# Altium project MCU_SLAVE.PrjPcb
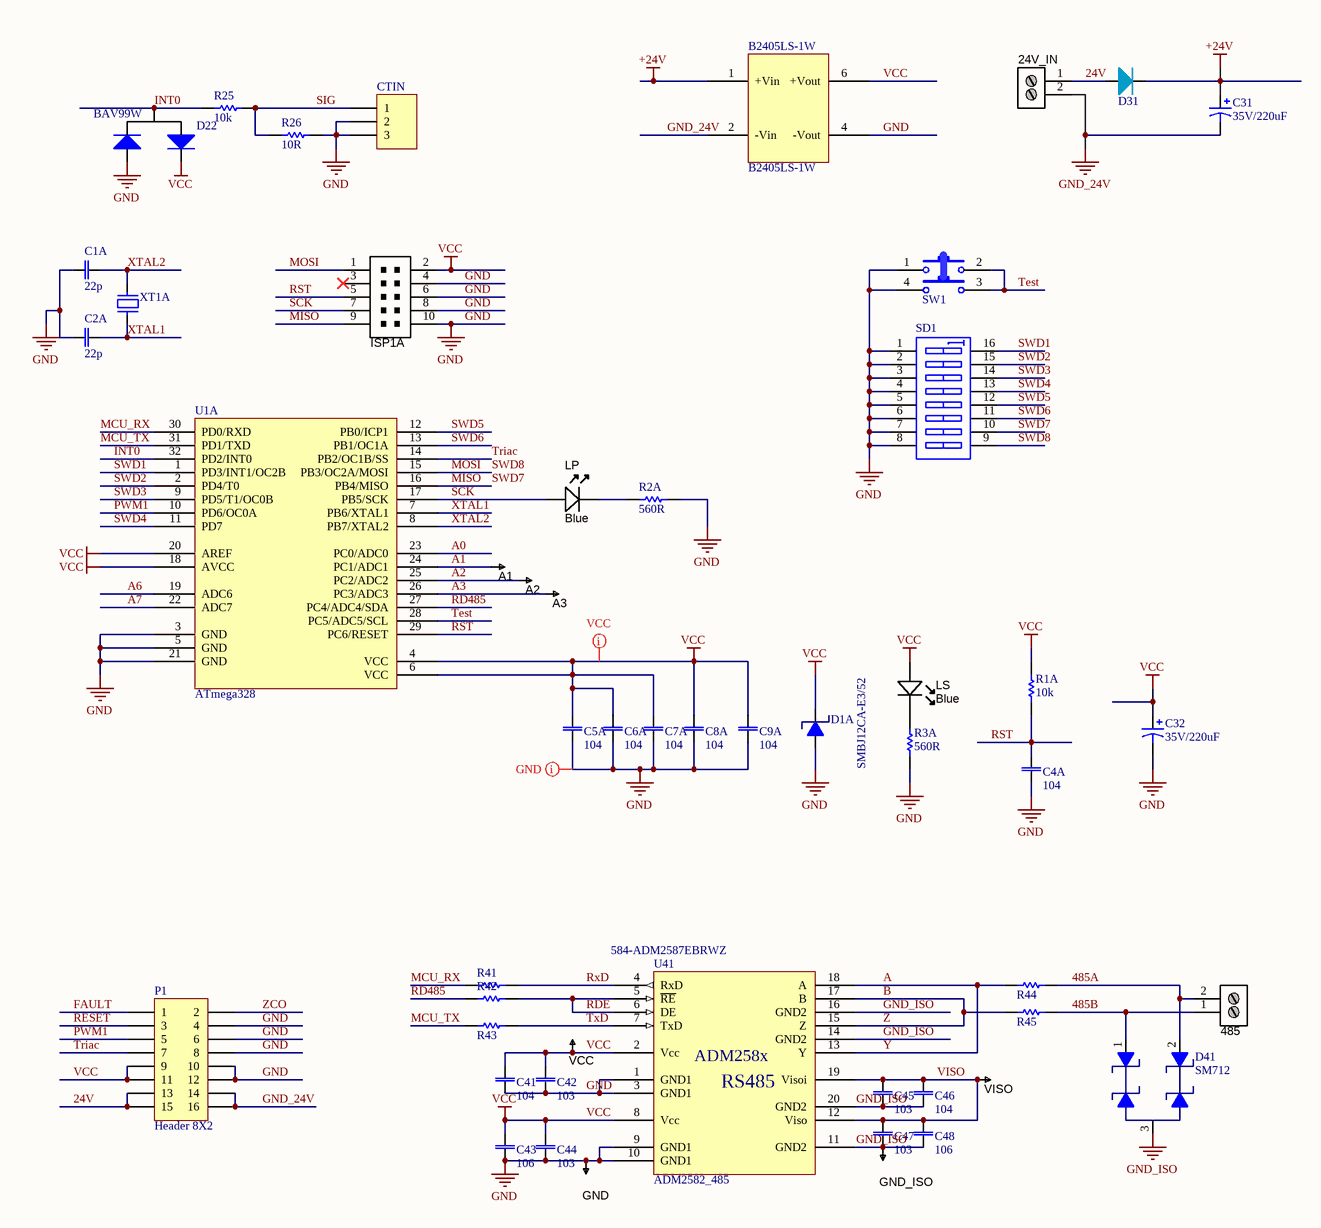
[diagram p0: MCU_SLAVE.SchDoc]
1 sheet, 52 parts. Net scope: global (net labels, ports and power ports of the same name join across sheets).
Board file: MCU_SLAVE.PcbDoc

## Sheet MCU_SLAVE.SchDoc
size A3; DocumentNumber: 2; SheetNumber: 1

### Parts
24V_IN  Giắc xanh 5.08mm  [2P_PCB1]  (value not drawn)
485  Giắc xanh 5.08mm  [2P_PCB1]  (value not drawn)
A1  TESTPOINT  [TP-R60]  (value not drawn)  (no BOM)
A2  TESTPOINT  [TP-R60]  (value not drawn)  (no BOM)
A3  TESTPOINT  [TP-R60]  (value not drawn)  (no BOM)
B2405LS-1W  B2405LS-1W  [Mornsun 1W]
C1A  value 22p  [CAPC2012N_F]  (hidden comment: Tụ điện dán 060322p)
C2A  value 22p  [CAPC2012N_F]  (hidden comment: Tụ điện dán 060322p)
C4A  value 104  [CAPC2012N_F]  (hidden comment: Tụ điện dán 0603104)
C5A  value 104  [CAPC2012N_F]  (hidden comment: Tụ điện dán 0805104)
C6A  value 104  [CAPC2012N_F]  (hidden comment: Tụ điện dán 0805104)
C7A  value 104  [CAPC2012N_F]  (hidden comment: Tụ điện dán 0603104)
C8A  value 104  [CAPC2012N_F]  (hidden comment: Tụ điện dán 0603104)
C9A  value 104  [CAPC2012N_F]  (hidden comment: Tụ điện dán 0603104)
C31  value 35V/220uF  [CAPE3.5-5.0MM_Rad_10x14mm]  (hidden comment: Tụ nhôm cắm35V/220uF)
C32  value 35V/220uF  [CAPE3.5-5.0MM_Rad_10x14mm]  (hidden comment: Tụ nhôm cắm35V/220uF)
C41  value 104  [CAPC2012N_F]  (hidden comment: Tụ điện dán 0805104)
C42  value 103  [CAPC2012N_F]  (hidden comment: Tụ điện dán 0805103)
C43  value 106  [CAPC2012N_F]  (hidden comment: Tụ điện dán 0805106)
C44  value 103  [CAPC2012N_F]  (hidden comment: Tụ điện dán 0805103)
C45  value 103  [CAPC2012N_F]  (hidden comment: Tụ điện dán 0805103)
C46  value 104  [CAPC2012N_F]  (hidden comment: Tụ điện dán 0805104)
C47  value 103  [CAPC2012N_F]  (hidden comment: Tụ điện dán 0805103)
C48  value 106  [CAPC2012N_F]  (hidden comment: Tụ điện dán 0805106)
CTIN  Header 3  [HDR1X3]  (value not drawn)
D1A  vl2: SMBJ12CA-E3/52  [DO-214AC]  (hidden comment: Đi ốt dánSMBJ12CA-E3/52)
D22  Đi ốt dánBAV99Wchân SOT-323  [SOT323]  (value not drawn)
D31  (no value)  [DO-214AC]
D41  SM712  [SOT23 TOP]
GND  TESTPOINT  [TP-R60]  (value not drawn)  (no BOM)
GND_ISO  TESTPOINT  [TP-R60]  (value not drawn)  (no BOM)
ISP1A  Giắc đôi 5x2 chân 2.54mm  [10P_PCB_HEADER_BRD_MNT]  (value not drawn)
LP  Blue  [LED-0805-K]
LS  Blue  [LED-0805-K]
P1  Header 8X2  [HDR2X8]
R1A  value 10k  [RESC2012N_F]  (hidden comment: Điện trở dán 060310k)
R2A  value 560R  [RESC2012N_F]  (hidden comment: Điện trở dán 0603560R)
R3A  value 560R  [RESC2012N_F]  (hidden comment: Điện trở dán 0603560R)
R25  value 10k  [RESC3216N]  (hidden comment: Điện trở dán 120610k)
R26  value 10R  [RESC3216N]  (hidden comment: Điện trở dán 120610R)
R41  Điện trở dán 08050R  [RESC2012N_F]  (value not drawn)
R42  Điện trở dán 08050R  [RESC2012N_F]  (value not drawn)
R43  Điện trở dán 08050R  [RESC2012N_F]  (value not drawn)
R44  Điện trở dán 08050R  [RESC2012N_F]  (value not drawn)
R45  Điện trở dán 08050R  [RESC2012N_F]  (value not drawn)
SD1  Công tắc gạt 8 kênh, 16 chân cắm DIP16  [DIP16/W0.3K]  (value not drawn)
SW1  Nút bấm 4 chân cắm12x12x6mm  [SW]  (value not drawn)
U1A  ATmega328  [TQFP32]
U41  ADM2582_485  Supplier Part Number 1: 584-ADM2587EBRWZ  [SO-20B]
VCC  TESTPOINT  [TP-R60]  (value not drawn)  (no BOM)
VISO  TESTPOINT  [TP-R60]  (value not drawn)  (no BOM)
XT1A  Thạch anh cắm 16MHz  [XT2]  (value not drawn)

### Nets
+24V: B2405LS-1W.1(+Vin) C31.1 D31.K
GND: B2405LS-1W.4(-Vout) C1A.2 C2A.2 C4A.1 C5A.1 C6A.1 C7A.1 C8A.1 C9A.1 C32.2 C41.1 C42.1 C43.1 C44.1 CTIN.2 CTIN.3 D1A.A D22.1(A) GND.1 ISP1A.4 ISP1A.6 ISP1A.8 ISP1A.10 P1.4 P1.6 P1.8 P1.10 P1.12 R2A.2 R3A.1 R26.1 SD1.1(A1) SD1.2(A2) SD1.3(A3) SD1.4(A4) SD1.5(A5) SD1.6(A6) SD1.7(A7) SD1.8(A8) SW1.1 SW1.4 U1A.3(GND) U1A.5(GND) U1A.21(GND) U41.1(GND1) U41.3(GND1) U41.9(GND1) U41.10(GND1)
GND_24V: 24V_IN.2 B2405LS-1W.2(-Vin) C31.2 P1.14 P1.16
GND_ISO: C45.1 C46.1 C47.1 C48.1 D41.3(GND) GND_ISO.1 U41.11(GND2) U41.14(GND2) U41.16(GND2) U41.20(GND2)
VCC: B2405LS-1W.6(+Vout) C5A.2 C6A.2 C7A.2 C8A.2 C9A.2 C32.1 C41.2 C42.2 C43.2 C44.2 D1A.K D22.2(K) ISP1A.2 LS.A P1.9 P1.11 R1A.2 U1A.4(VCC) U1A.6(VCC) U1A.18(AVCC) U1A.20(AREF) U41.2(Vcc) U41.8(Vcc) VCC.1
24V: 24V_IN.1 D31.A P1.13 P1.15
485A: 485.2 D41.2(IO2) R44.2
485B: 485.1 D41.1(IO1) R45.2
A: R44.1 U41.13(Y) U41.18(A)  [also labelled Y]
A0: U1A.23(PC0/ADC0)
A1: A1.1 U1A.24(PC1/ADC1)
A2: A2.1 U1A.25(PC2/ADC2)
A3: A3.1 U1A.26(PC3/ADC3)
A6: U1A.19(ADC6)
A7: U1A.22(ADC7)
B: R45.1 U41.15(Z) U41.17(B)  [also labelled Z]
FAULT: P1.1
INT0: D22.3(AK) R25.2 U1A.32(PD2/INT0)
MCU_RX: R41.1 U1A.30(PD0/RXD)
MCU_TX: R43.1 U1A.31(PD1/TXD)
MISO: ISP1A.9 SD1.10(B7) U1A.16(PB4/MISO)  [also labelled SWD7]
MOSI: ISP1A.1 SD1.9(B8) U1A.15(PB3/OC2A/MOSI)  [also labelled SWD8]
PWM1: P1.5 U1A.10(PD6/OC0A)
RD485: R42.1 U1A.27(PC4/ADC4/SDA)
RDE: R42.2 U41.5(~{RE}) U41.6(DE)
RESET: P1.3
RST: C4A.2 ISP1A.5 R1A.1 U1A.29(PC6/RESET)
RxD: R41.2 U41.4(RxD)
SCK: ISP1A.7 LP.A U1A.17(PB5/SCK)
SIG: CTIN.1 R25.1 R26.2
SWD1: SD1.16(B1) U1A.1(PD3/INT1/OC2B)
SWD2: SD1.15(B2) U1A.2(PD4/T0)
SWD3: SD1.14(B3) U1A.9(PD5/T1/OC0B)
SWD4: SD1.13(B4) U1A.11(PD7)
SWD5: SD1.12(B5) U1A.12(PB0/ICP1)
SWD6: SD1.11(B6) U1A.13(PB1/OC1A)
Test: SW1.2 SW1.3 U1A.28(PC5/ADC5/SCL)
Triac: P1.7 U1A.14(PB2/OC1B/SS)
TxD: R43.2 U41.7(TxD)
VISO: C45.2 C46.2 C47.2 C48.2 U41.12(Viso) U41.19(Visoi) VISO.1
XTAL1: C2A.1 U1A.7(PB6/XTAL1) XT1A.1
XTAL2: C1A.1 U1A.8(PB7/XTAL2) XT1A.2
ZCO: P1.2
NetLP_K: LP.K R2A.1
NetLS_K: LS.K R3A.2

Not connected (* = marked no-connect by the designer): ISP1A 3*

### Layout directives
rule Width Constraint [Pref Width = 10mil    Min Width = 10mil    Max Width = 30mil]: VCC
rule Width Constraint [Pref Width = 10mil    Min Width = 10mil    Max Width = 15mil]: GND

### Notes on the sheet
- (in symbol ADM2582_485) ADM258x; RS485

### Library data of the parts
24V_IN 485 = 2P_ScrewTerm_90S_3.81MM: Terminal Block Screw Type THT 2-Position 3.81mm pitch; Manufacturer 1: Tyco Electronics; Manufacturer Part Number 1: 1776113-2; Value: 2 position; Pitch: 0.150" (3.81mm); Positions Per Level: 2; Package / Case: Side Entry; 3.81mm pitch; Category: Connectors Interconnects; Color: Black; Supplier 1: Digi-Key; Supplier Part Number 1: A97976-ND; vl: Giắc xanh 5.08mm
A1-A3 GND GND_ISO VCC VISO = TESTPOINT: SMD test pin
B2405LS-1W = Mornsun 0505 1W
C1A C2A C4A C7A C8A C9A = CAP NP: Capacitor non polarized; cm2: Tụ điện dán 0805; cm3: Tụ điện dán 1206; cm1: Tụ điện dán 0603
C5A C6A C41-C48 = CAP NP: Capacitor non polarized; cm1: Tụ điện dán 0603; cm3: Tụ điện dán 1206; cm2: Tụ điện dán 0805
C31 C32 = Cap: cm: Tụ nhôm cắm
CTIN = Header 3: Header, 3-Pin; LatestRevisionDate: 17-Jul-2002; LatestRevisionNote: Re-released for DXP Platform.; Publisher: Altium Limited
D1A = TVS Diodes: TVS Diodes - Transient Voltage Suppressors; SMBJ12CA-E3/52: 12V,600W,DO-214AA; SMAJ5.0A: TVS Diodes - Transient Voltage Suppressors 5volts 400watts UniDirectional; vl1: SMAJ5.0A; cm1: Đi ốt dán
D22 = BAV99W: Diode Array 1 Pair Series Connection Standard 70V 215mA (DC) Surface Mount SC-70, SOT-323; vl2: BAV70; Des: Diode Array 1 Pair Series Connection Standard 70V 215mA (DC) Surface Mount SC-70, SOT-323; cm1: Đi ốt dán; vl1: BAV99W; cm2: chân SOT-323
D31 = Diode: cm1: Đi ốt cắm; cm2: Đi ốt dán; vl2: FR307; vl3: TVS 1.5KE300A 19A 300V; vl4: HER508 5A 1000V
D41 = SM712: The SM712 transient voltage suppressor (TVS) diode  is designed for asymmetrical (12V to -7V) protection  in multi-point data transmission standard RS-485  applications.; pin to pad: 2>3 3>2
ISP1A = CONN_HEADER_2x5P_0.100in_Male: Header THD 10 POS Double-row 2.54mm pitch; Manufacturer 1: 3M; Manufacturer Part Number 1: D2510-6002-AR; Pitch: 0.100" (2.54mm); Value: Double-row, 10 positions; QtyOverride: 1; Connector Type: Header, Shrouded; Number of Positions: 10; Package / Case: Connector header; 2.54mm pitch; Contact Type: Male Pin; Number of Rows: 2; Row Spacing: 0.100" (2.54mm); Contact Mating Length: 0.243" (6.17mm); ComponentLink1URL: http://multimedia.3m.com/mws/mediawebserver?66666UuZjcFSLXTtm8T_oxMcEVuQEcuZgVs6EVs6E666666--; ComponentLink1Description: http://multimedia.3m.com/mws/mediawebserver?66666UuZjcFSLXTtm8T_oxMcEVuQEcuZgVs6EVs6E666666--; Supplier 1: Digi-Key; Supplier Part Number 1: MHC10E-ND
LP LS = LED_SMD_Blue_0805_100mcd: LED 0805 SMD Blue 100mcd 470nm; Manufacturer 1: Ligitek; Manufacturer Part Number 1: LG-170DBKZ-CT; Ratings: 100 mcd; 470 nm; Package / Case: 0805; Material: InGaN/GaN; Value: Blue; Color: Blue
P1 = Header 8X2: Header, 8-Pin, Dual row; LatestRevisionDate: 17-Jul-2002; LatestRevisionNote: Re-released for DXP Platform.; Publisher: Altium Limited
R1A R2A R3A = Res: Resistor; cm2: Điện trở cắm 1/4W; cm3: Điện trở dán 0805; cm4: Điện trở dán 1206; cm1: Điện trở dán 0603
R25 R26 = Res: Resistor; cm1: Điện trở dán 0603; cm2: Điện trở cắm 1/4W; cm3: Điện trở dán 0805; cm4: Điện trở dán 1206
R41-R45 = Res: Resistor; cm1: Điện trở dán 0603; cm2: Điện trở cắm 1/4W; cm4: Điện trở dán 1206; Value: 0R; cm3: Điện trở dán 0805
SD1 = SWDIP-8: DIP Switch, 8 Position, SPST; Value: SW - DIP8; cm1: Công tắc gạt 8 kênh, 16 chân cắm DIP16
SW1 = SW-4P-Small: cm1: Nút bấm 4 chân cắm; vl1: 12x12x6mm
U1A = ATmega48/168/328: AVR AVR® ATmega Microcontroller IC 8-Bit 20MHz 8KB (4K x 16) FLASH 32-TQFP (7x7)
U41 = ADM2582_485: Manufacturer: Analog Devices; Manufacturer Part Number: ADM2587EBRWZ; Description: ANALOG DEVICES   ADM2587EBRWZ   RS485 Transceiver, 3V-5.5V Supply, SOIC-20; Number of Transmitters: 1; Operating Supply Voltage: 5V; Logic Function: Transceiver; Interface: RS-422,RS-485; Propagation Delay: 200ns; Min Supply Voltage: 3V; Max Supply Voltage: 5.5V; Nominal Supply Current: 125mA; Data Rate: 500Kbps; Number of Channels: 3; Channel Type: Unidirectional; Isolated Power: Yes; Frequency: 500kHz; Isolation Voltage: 2.5kV; Simplex/Duplex: Full Duplex; Supplier 1: Mouser; Stock 1: 5252; Pricing 1: 1=11.82, 10=10.73, 50=9.71, 100=8.73, 1000=6.9, 10000=6.9 (USD); Mount: Surface Mount; Case/Package: SOIC; Number of Pins: 20; Contact Plating: Matte,Tin; Min Operating Temperature: -40°C; Max Operating Temperature: 85°C; Packaging: Rail/Tube; Package Quantity: 37; Number of Receivers: 1; Operating Supply Current: 125mA; Number of Transceivers: 1; Number of Drivers: 1; Max Supply Current: 125mA; ESD Protection: Yes; Length: 13mm; Height: 2.35mm; Width: 7.6mm; Radiation Hardening: No; Lead Free: Contains Lead; REACH SVHC: No SVHC; ComponentLink1URL: http://www.analog.com/static/imported-files/data_sheets/ADM2582E_2587E.pdf; ComponentLink1Description: http://www.analog.com/static/imported-files/data_sheets/ADM2582E_2587E.pdf; ComponentLink2URL: https://www.distrelec.biz/Web/Downloads/_t/ds/ADM2587E_eng_tds.pdf?mime=application%2Fpdf; ComponentLink2Description: https://www.distrelec.biz/Web/Downloads/_t/ds/ADM2587E_eng_tds.pdf?mime=application%2Fpdf; ComponentLink3URL: https://www.analog.com/media/en/technical-documentation/data-sheets/ADM2582E_2587E.pdf; ComponentLink3Description: https://www.analog.com/media/en/technical-documentation/data-sheets/ADM2582E_2587E.pdf; ComponentLink4URL: http://www.produktinfo.conrad.com/datenblaetter/1200000-1299999/001248353-da-01-en-IC_TXRX_RS485_I_ADM2587EBRWZ_SOIC_20_ADI.pdf; ComponentLink4Description: http://www.produktinfo.conrad.com/datenblaetter/1200000-1299999/001248353-da-01-en-IC_TXRX_RS485_I_ADM2587EBRWZ_SOIC_20_ADI.pdf; ComponentLink5URL: http://datasheet.iiic.cc/analog_devices/ADM2587EBRWZ.pdf; ComponentLink5Description: http://datasheet.iiic.cc/analog_devices/ADM2587EBRWZ.pdf
XT1A = Crystal